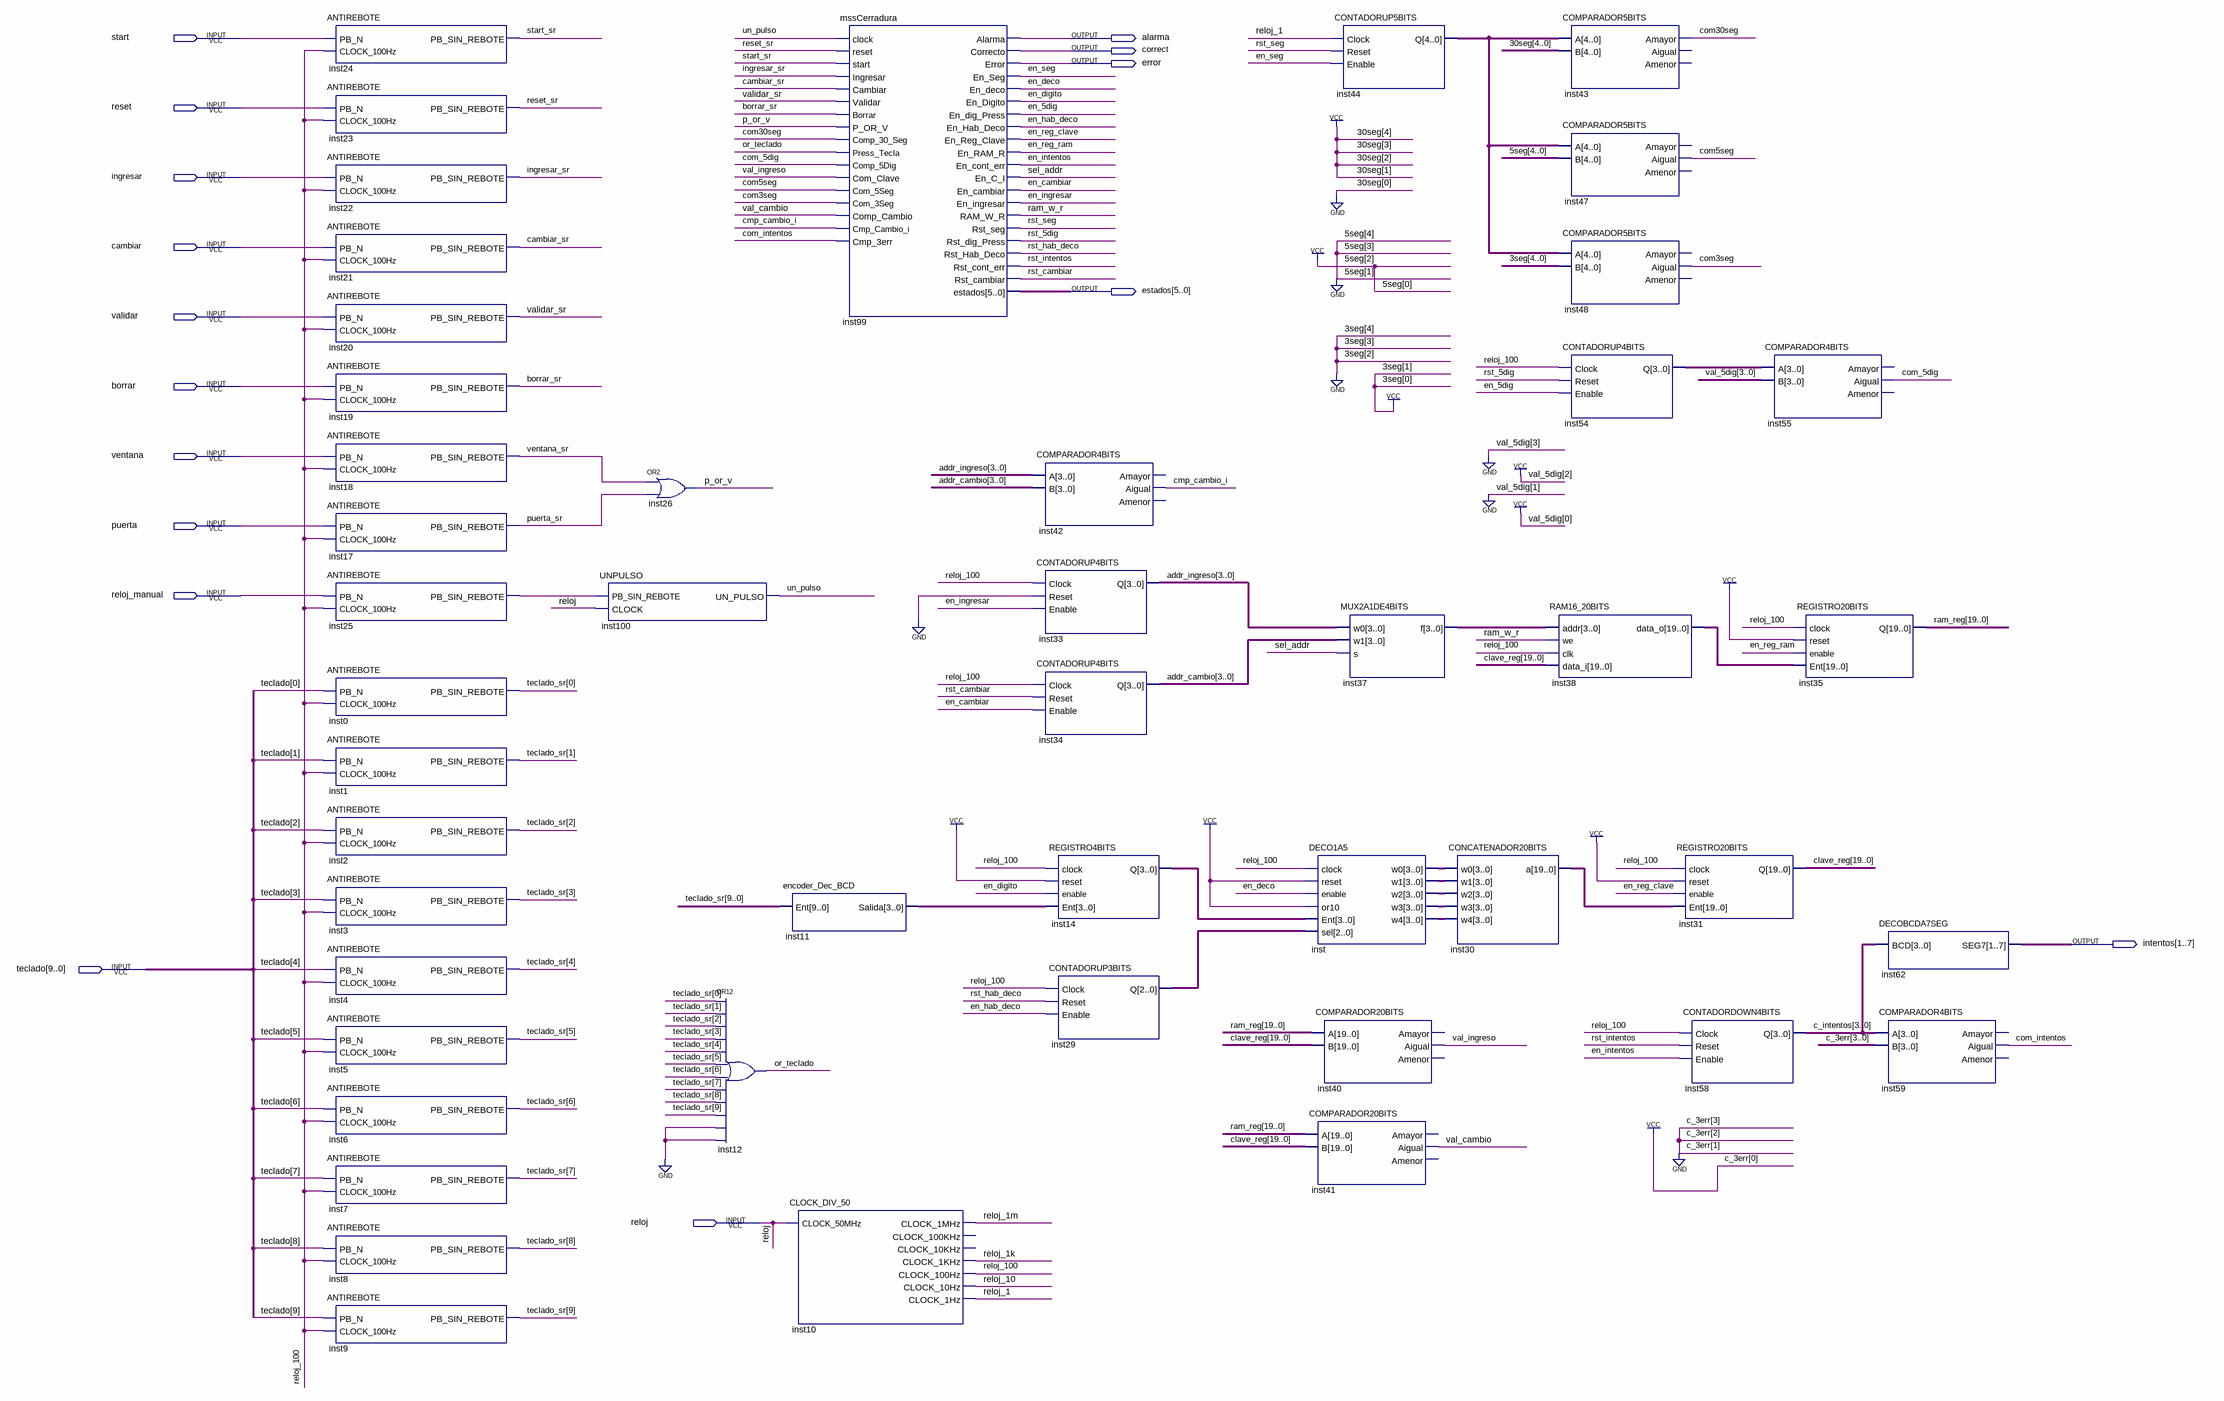
[diagram p0: schematic sheet]
// Quartus schematic proyectoCerradura.bdf as structural Verilog: 47 symbols, 16 pins
module proyectoCerradura (
  input  start,
  input  reset,
  input  ingresar,
  input  cambiar,
  input  validar,
  input  borrar,
  input  ventana,
  input  puerta,
  input  reloj_manual,
  input  [9:0] teclado,
  input  reloj,
  output alarma,
  output correct,
  output error,
  output [5:0] estados,
  output [1:7] intentos
);

  wire borrar_sr, cambiar_sr, cmp_cambio_i, com3seg, com5seg, com30seg, com_5dig, com_intentos, en_5dig,
       en_cambiar, en_deco, en_digito, en_hab_deco, en_ingresar, en_intentos, en_reg_clave, en_reg_ram,
       en_seg, ingresar_sr, inst25_pb_sin_rebote, or_teclado, p_or_v, puerta_sr, ram_w_r, reloj_1, reloj_1k,
       reloj_1m, reloj_10, reloj_100, reset_sr, rst_5dig, rst_cambiar, rst_hab_deco, rst_intentos, rst_seg,
       sel_addr, start_sr, un_pulso, val_cambio, val_ingreso, validar_sr, ventana_sr;
  wire [2:0] inst29_q;
  wire [3:0] addr_cambio, addr_ingreso, c_intentos, inst11_salida, inst14_q, inst37_f, inst54_q, inst_w0,
       inst_w1, inst_w2, inst_w3, inst_w4;
  wire [4:0] inst44_q;
  wire [9:0] teclado_sr;
  wire [19:0] clave_reg, inst30_a, inst38_data_o, ram_reg;

  ANTIREBOTE inst24 (.PB_N(start), .CLOCK_100Hz(reloj_100), .PB_SIN_REBOTE(start_sr));
  ANTIREBOTE inst23 (.PB_N(reset), .CLOCK_100Hz(reloj_100), .PB_SIN_REBOTE(reset_sr));
  ANTIREBOTE inst22 (.PB_N(ingresar), .CLOCK_100Hz(reloj_100), .PB_SIN_REBOTE(ingresar_sr));
  ANTIREBOTE inst21 (.PB_N(cambiar), .CLOCK_100Hz(reloj_100), .PB_SIN_REBOTE(cambiar_sr));
  ANTIREBOTE inst20 (.PB_N(validar), .CLOCK_100Hz(reloj_100), .PB_SIN_REBOTE(validar_sr));
  ANTIREBOTE inst19 (.PB_N(borrar), .CLOCK_100Hz(reloj_100), .PB_SIN_REBOTE(borrar_sr));
  ANTIREBOTE inst18 (.PB_N(ventana), .CLOCK_100Hz(reloj_100), .PB_SIN_REBOTE(ventana_sr));
  ANTIREBOTE inst17 (.PB_N(puerta), .CLOCK_100Hz(reloj_100), .PB_SIN_REBOTE(puerta_sr));
  ANTIREBOTE inst25 (.PB_N(reloj_manual), .CLOCK_100Hz(reloj_100), .PB_SIN_REBOTE(inst25_pb_sin_rebote));
  ANTIREBOTE inst0 (.PB_N(teclado[0]), .CLOCK_100Hz(reloj_100), .PB_SIN_REBOTE(teclado_sr[0]));
  ANTIREBOTE inst1 (.PB_N(teclado[1]), .CLOCK_100Hz(reloj_100), .PB_SIN_REBOTE(teclado_sr[1]));
  ANTIREBOTE inst2 (.PB_N(teclado[2]), .CLOCK_100Hz(reloj_100), .PB_SIN_REBOTE(teclado_sr[2]));
  ANTIREBOTE inst3 (.PB_N(teclado[3]), .CLOCK_100Hz(reloj_100), .PB_SIN_REBOTE(teclado_sr[3]));
  ANTIREBOTE inst4 (.PB_N(teclado[4]), .CLOCK_100Hz(reloj_100), .PB_SIN_REBOTE(teclado_sr[4]));
  ANTIREBOTE inst5 (.PB_N(teclado[5]), .CLOCK_100Hz(reloj_100), .PB_SIN_REBOTE(teclado_sr[5]));
  ANTIREBOTE inst6 (.PB_N(teclado[6]), .CLOCK_100Hz(reloj_100), .PB_SIN_REBOTE(teclado_sr[6]));
  ANTIREBOTE inst7 (.PB_N(teclado[7]), .CLOCK_100Hz(reloj_100), .PB_SIN_REBOTE(teclado_sr[7]));
  ANTIREBOTE inst8 (.PB_N(teclado[8]), .CLOCK_100Hz(reloj_100), .PB_SIN_REBOTE(teclado_sr[8]));
  ANTIREBOTE inst9 (.PB_N(teclado[9]), .CLOCK_100Hz(reloj_100), .PB_SIN_REBOTE(teclado_sr[9]));
  UNPULSO inst100 (.PB_SIN_REBOTE(inst25_pb_sin_rebote), .CLOCK(reloj), .UN_PULSO(un_pulso));
  or inst26 (p_or_v, ventana_sr, puerta_sr);
  or inst12 (or_teclado, teclado_sr[0], teclado_sr[1], teclado_sr[2], teclado_sr[3], teclado_sr[4], teclado_sr[5], teclado_sr[6], teclado_sr[7], teclado_sr[8], teclado_sr[9], 1'b0, 1'b0);
  encoder_Dec_BCD inst11 (.Ent(teclado_sr), .Salida(inst11_salida));
  CLOCK_DIV_50 inst10 (
    .CLOCK_50MHz(reloj), .CLOCK_1MHz(reloj_1m), .CLOCK_1KHz(reloj_1k), .CLOCK_100Hz(reloj_100),
    .CLOCK_10Hz(reloj_10), .CLOCK_1Hz(reloj_1));  // open: CLOCK_100KHz, CLOCK_10KHz
  mssCerradura inst99 (
    .clock(un_pulso), .reset(reset_sr), .start(start_sr), .Ingresar(ingresar_sr), .Cambiar(cambiar_sr),
    .Validar(validar_sr), .Borrar(borrar_sr), .P_OR_V(p_or_v), .Comp_30_Seg(com30seg),
    .Press_Tecla(or_teclado), .Comp_5Dig(com_5dig), .Com_Clave(val_ingreso), .Com_5Seg(com5seg),
    .Com_3Seg(com3seg), .Comp_Cambio(val_cambio), .Cmp_Cambio_i(cmp_cambio_i), .Cmp_3err(com_intentos),
    .Alarma(alarma), .Correcto(correct), .Error(error), .En_Seg(en_seg), .En_deco(en_deco),
    .En_Digito(en_digito), .En_dig_Press(en_5dig), .En_Hab_Deco(en_hab_deco), .En_Reg_Clave(en_reg_clave),
    .En_RAM_R(en_reg_ram), .En_cont_err(en_intentos), .En_C_I(sel_addr), .En_cambiar(en_cambiar),
    .En_ingresar(en_ingresar), .RAM_W_R(ram_w_r), .Rst_seg(rst_seg), .Rst_dig_Press(rst_5dig),
    .Rst_Hab_Deco(rst_hab_deco), .Rst_cont_err(rst_intentos), .Rst_cambiar(rst_cambiar), .estados(estados));
  COMPARADOR4BITS inst42 (.A(addr_ingreso), .B(addr_cambio), .Aigual(cmp_cambio_i));  // open: Amayor, Amenor
  CONTADORUP4BITS inst33 (.Clock(reloj_100), .Reset(1'b0), .Enable(en_ingresar), .Q(addr_ingreso));
  CONTADORUP4BITS inst34 (.Clock(reloj_100), .Reset(rst_cambiar), .Enable(en_cambiar), .Q(addr_cambio));
  REGISTRO4BITS inst14 (.clock(reloj_100), .reset(1'b1), .enable(en_digito), .Ent(inst11_salida), .Q(inst14_q));
  CONTADORUP3BITS inst29 (.Clock(reloj_100), .Reset(rst_hab_deco), .Enable(en_hab_deco), .Q(inst29_q));
  DECO1A5 inst (
    .clock(reloj_100), .reset(1'b1), .enable(en_deco), .or10(1'b1), .Ent(inst14_q), .sel(inst29_q),
    .w0(inst_w0), .w1(inst_w1), .w2(inst_w2), .w3(inst_w3), .w4(inst_w4));
  COMPARADOR20BITS inst40 (.A(ram_reg), .B(clave_reg), .Aigual(val_ingreso));  // open: Amayor, Amenor
  COMPARADOR20BITS inst41 (.A(ram_reg), .B(clave_reg), .Aigual(val_cambio));  // open: Amayor, Amenor
  CONTADORUP5BITS inst44 (.Clock(reloj_1), .Reset(rst_seg), .Enable(en_seg), .Q(inst44_q));
  MUX2A1DE4BITS inst37 (.w0(addr_ingreso), .w1(addr_cambio), .s(sel_addr), .f(inst37_f));
  CONCATENADOR20BITS inst30 (.w0(inst_w0), .w1(inst_w1), .w2(inst_w2), .w3(inst_w3), .w4(inst_w4), .a(inst30_a));
  COMPARADOR5BITS inst43 (.A(inst44_q), .B(5'b11110), .Amayor(com30seg));  // open: Aigual, Amenor
  COMPARADOR5BITS inst47 (.A(inst44_q), .B(5'b00101), .Aigual(com5seg));  // open: Amayor, Amenor
  COMPARADOR5BITS inst48 (.A(inst44_q), .B(5'b00011), .Aigual(com3seg));  // open: Amayor, Amenor
  CONTADORUP4BITS inst54 (.Clock(reloj_100), .Reset(rst_5dig), .Enable(en_5dig), .Q(inst54_q));
  RAM16_20BITS inst38 (.addr(inst37_f), .we(ram_w_r), .clk(reloj_100), .data_i(clave_reg), .data_o(inst38_data_o));
  REGISTRO20BITS inst31 (.clock(reloj_100), .reset(1'b1), .enable(en_reg_clave), .Ent(inst30_a), .Q(clave_reg));
  CONTADORDOWN4BITS inst58 (.Clock(reloj_100), .Reset(rst_intentos), .Enable(en_intentos), .Q(c_intentos));
  COMPARADOR4BITS inst55 (.A(inst54_q), .B(4'b0101), .Aigual(com_5dig));  // open: Amayor, Amenor
  REGISTRO20BITS inst35 (.clock(reloj_100), .reset(1'b1), .enable(en_reg_ram), .Ent(inst38_data_o), .Q(ram_reg));
  DECOBCDA7SEG inst62 (.BCD(c_intentos), .SEG7(intentos));
  COMPARADOR4BITS inst59 (.A(c_intentos), .B(4'b0001), .Aigual(com_intentos));  // open: Amayor, Amenor
endmodule
